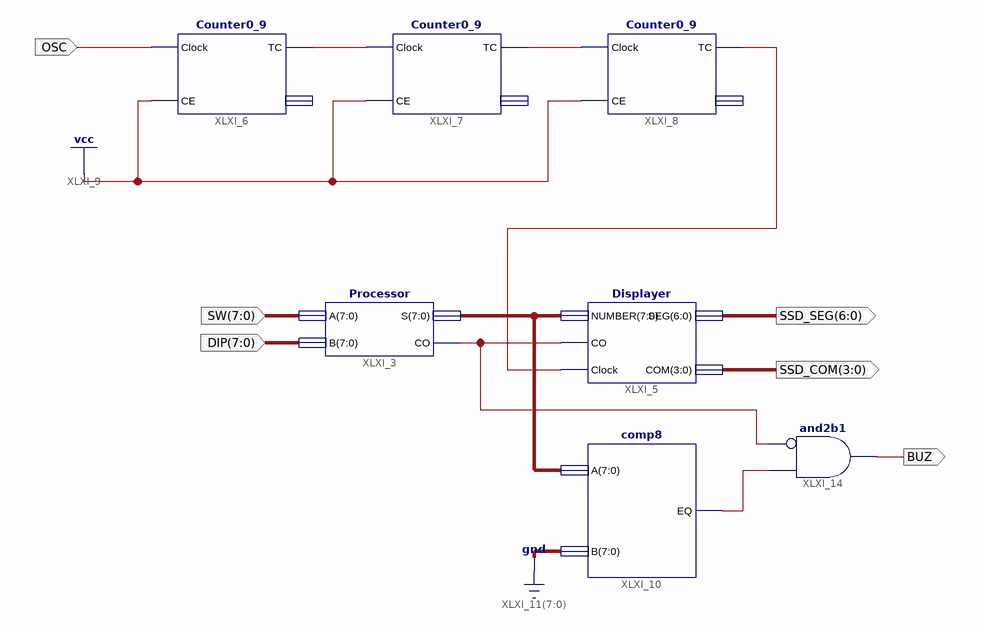
[diagram p0: schematic sheet 1]
// Xilinx ISE schematic main.sch (spartan6) as structural Verilog: 7 symbols, 6 ports
module main (
  input  [7:0] SW,
  input  [7:0] DIP,
  input  OSC,
  output [6:0] SSD_SEG,
  output [3:0] SSD_COM,
  output BUZ
);

  wire XLXN_4, XLXN_6, XLXN_7, XLXN_14, XLXN_24;
  wire [7:0] LED;

  Processor XLXI_3 (.A(SW), .B(DIP), .S(LED), .CO(XLXN_4));
  Displayer XLXI_5 (.NUMBER(LED), .CO(XLXN_4), .Clock(XLXN_14), .SEG(SSD_SEG), .COM(SSD_COM));
  Counter0_9 XLXI_6 (.Clock(OSC), .CE(1'b1), .TC(XLXN_6));  // open: Count
  Counter0_9 XLXI_7 (.Clock(XLXN_6), .CE(1'b1), .TC(XLXN_7));  // open: Count
  Counter0_9 XLXI_8 (.Clock(XLXN_7), .CE(1'b1), .TC(XLXN_14));  // open: Count
  comp8 XLXI_10 (.A(LED), .B({8{1'b0}}), .EQ(XLXN_24));
  and XLXI_14 (BUZ, ~XLXN_4, XLXN_24);  // and2b1
endmodule
